# EAGLE schematic ARM Flight Controller (EAGLE 6.0)
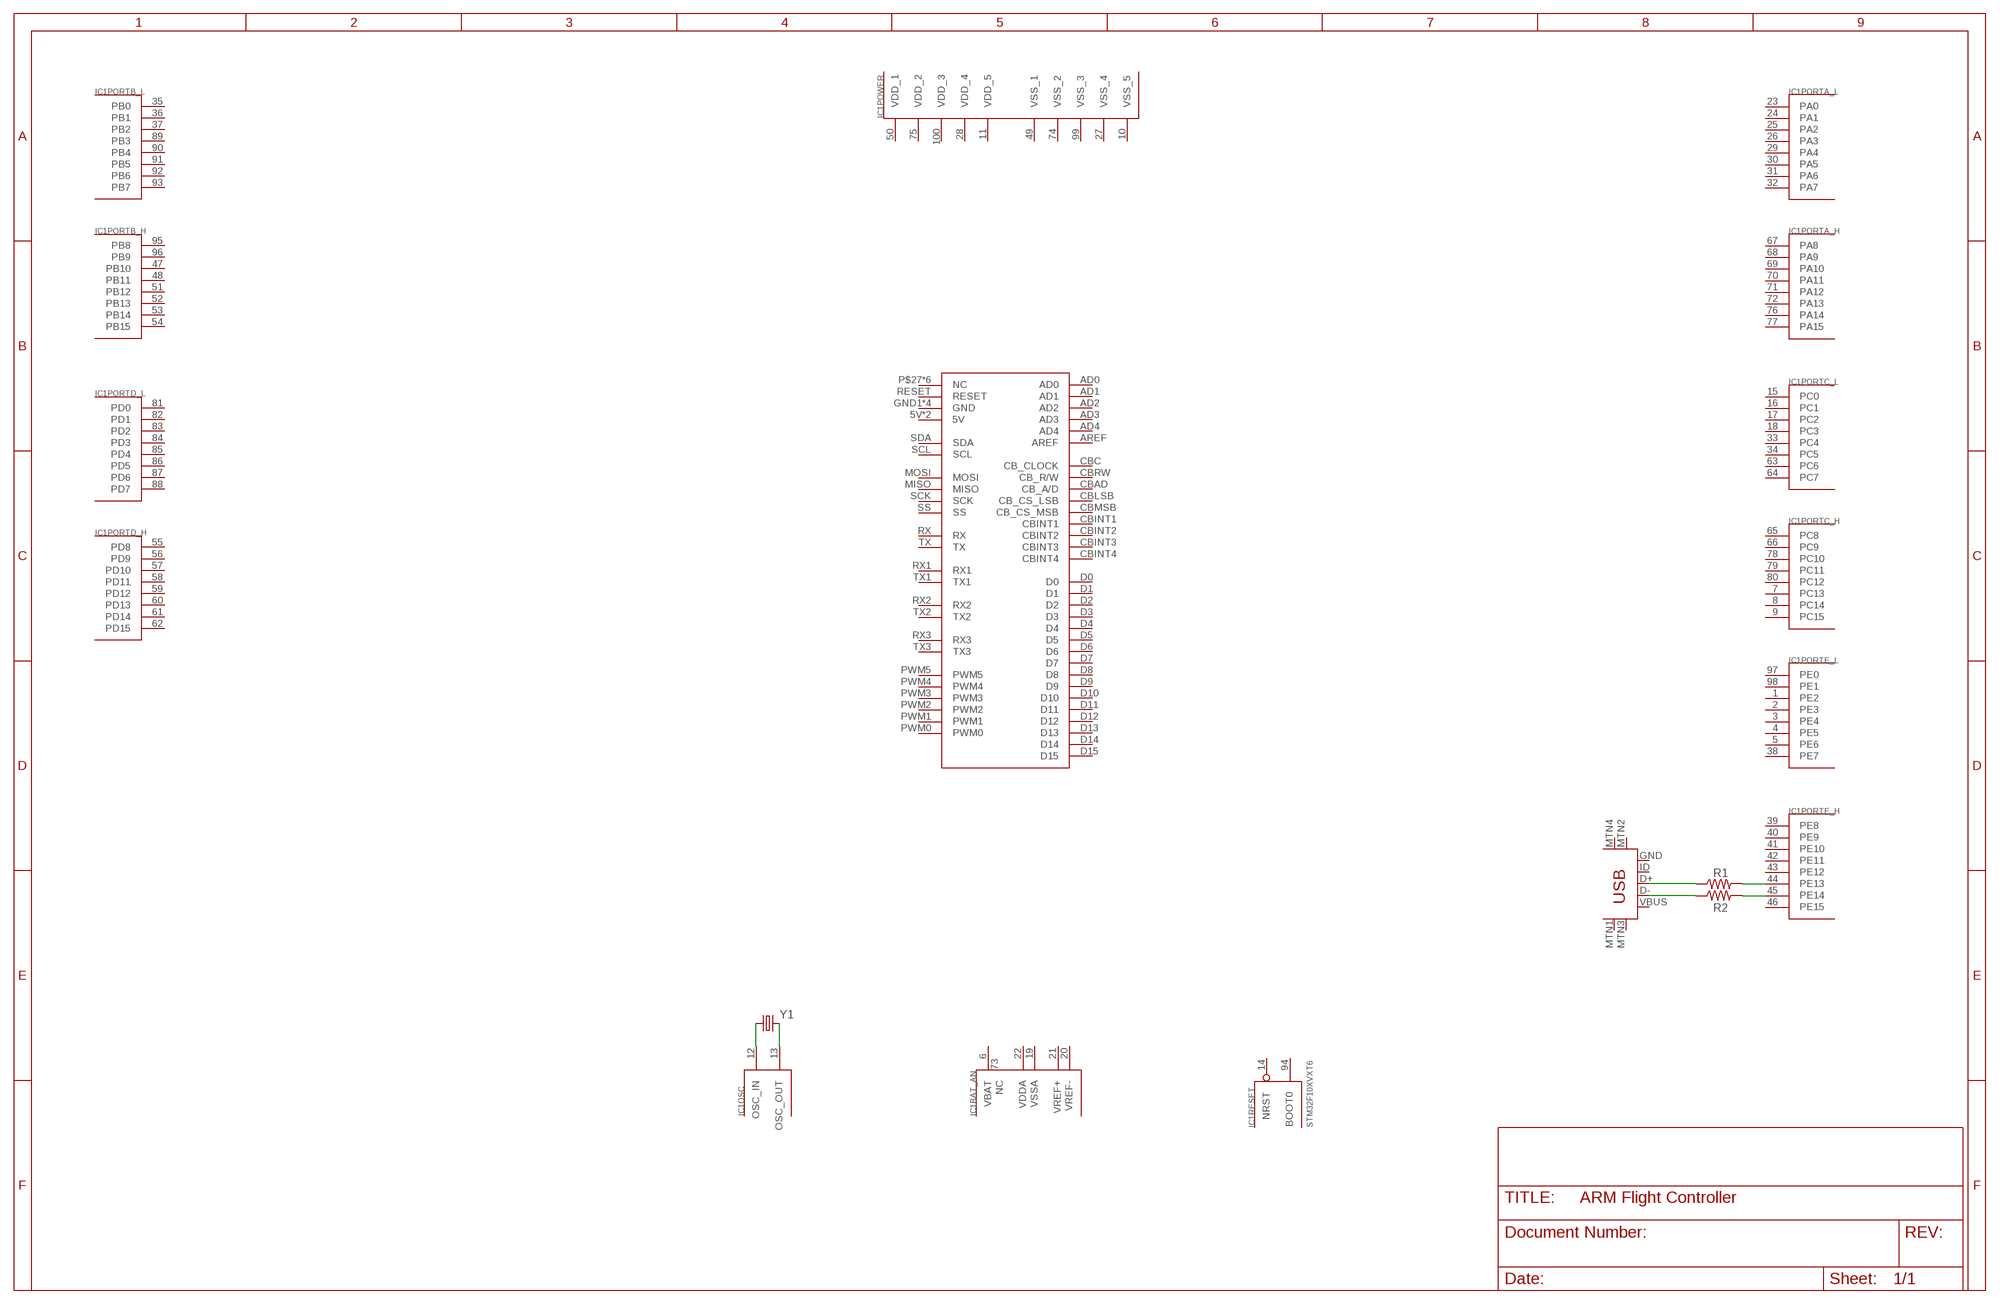
[diagram p0: schematic, sheet 1]

## Parts
IC1  STM32F10XVXT6  [TQFP100]
R1  RESISTOR0805-RES  [0805]
R2  RESISTOR0805-RES  [0805]
U$1  USB-MINIB-5PIN  [USB-MINIB]
U$2  MEGA_MININOSILK  [MEGAMINI_NOSILK]
Y1  CRYSTAL5X3  [CRYSTAL-SMD-5X3]

## Nets
N$1: R1.1 U$1.D+
N$2: R2.1 U$1.D-
N$3: IC1.44(PORTE_H:PE13) R1.2
N$4: IC1.45(PORTE_H:PE14) R2.2
N$5: IC1.13(OSC:OSC_OUT) Y1.3
N$6: IC1.12(OSC:OSC_IN) Y1.1
Unconnected: IC1.1(PORTE_L:PE2) IC1.2(PORTE_L:PE3) IC1.3(PORTE_L:PE4) IC1.4(PORTE_L:PE5) IC1.5(PORTE_L:PE6) IC1.7(PORTC_H:PC13) IC1.8(PORTC_H:PC14) IC1.9(PORTC_H:PC15) IC1.14(RESET:NRST) IC1.15(PORTC_L:PC0) IC1.16(PORTC_L:PC1) IC1.17(PORTC_L:PC2) IC1.18(PORTC_L:PC3) IC1.20(BAT_AN:VREF-) IC1.21(BAT_AN:VREF+) IC1.23(PORTA_L:PA0) IC1.24(PORTA_L:PA1) IC1.25(PORTA_L:PA2) IC1.26(PORTA_L:PA3) IC1.29(PORTA_L:PA4) IC1.30(PORTA_L:PA5) IC1.31(PORTA_L:PA6) IC1.32(PORTA_L:PA7) IC1.33(PORTC_L:PC4) IC1.34(PORTC_L:PC5) IC1.35(PORTB_L:PB0) IC1.36(PORTB_L:PB1) IC1.37(PORTB_L:PB2) IC1.38(PORTE_L:PE7) IC1.39(PORTE_H:PE8) IC1.40(PORTE_H:PE9) IC1.41(PORTE_H:PE10) IC1.42(PORTE_H:PE11) IC1.43(PORTE_H:PE12) IC1.46(PORTE_H:PE15) IC1.47(PORTB_H:PB10) IC1.48(PORTB_H:PB11) IC1.51(PORTB_H:PB12) IC1.52(PORTB_H:PB13) IC1.53(PORTB_H:PB14) IC1.54(PORTB_H:PB15) IC1.55(PORTD_H:PD8) IC1.56(PORTD_H:PD9) IC1.57(PORTD_H:PD10) IC1.58(PORTD_H:PD11) IC1.59(PORTD_H:PD12) IC1.60(PORTD_H:PD13) IC1.61(PORTD_H:PD14) IC1.62(PORTD_H:PD15) IC1.63(PORTC_L:PC6) IC1.64(PORTC_L:PC7) IC1.65(PORTC_H:PC8) IC1.66(PORTC_H:PC9) IC1.67(PORTA_H:PA8) IC1.68(PORTA_H:PA9) IC1.69(PORTA_H:PA10) IC1.70(PORTA_H:PA11) IC1.71(PORTA_H:PA12) IC1.72(PORTA_H:PA13) IC1.73(BAT_AN:NC) IC1.76(PORTA_H:PA14) IC1.77(PORTA_H:PA15) IC1.78(PORTC_H:PC10) IC1.79(PORTC_H:PC11) IC1.80(PORTC_H:PC12) IC1.81(PORTD_L:PD0) IC1.82(PORTD_L:PD1) IC1.83(PORTD_L:PD2) IC1.84(PORTD_L:PD3) IC1.85(PORTD_L:PD4) IC1.86(PORTD_L:PD5) IC1.87(PORTD_L:PD6) IC1.88(PORTD_L:PD7) IC1.89(PORTB_L:PB3) IC1.90(PORTB_L:PB4) IC1.91(PORTB_L:PB5) IC1.92(PORTB_L:PB6) IC1.93(PORTB_L:PB7) IC1.94(RESET:BOOT0) IC1.95(PORTB_H:PB8) IC1.96(PORTB_H:PB9) IC1.97(PORTE_L:PE0) IC1.98(PORTE_L:PE1) U$1.GND U$1.ID U$1.MTN1(MTN2) U$1.MTN2(MTN3) U$1.MTN3(MTN1) U$1.MTN4 U$1.VBUS U$2.5V U$2.5V2(5V) U$2.AD0 U$2.AD1 U$2.AD2 U$2.AD3 U$2.AD4 U$2.AREF U$2.CBAD(CB_A/D) U$2.CBC(CB_CLOCK) U$2.CBINT1 U$2.CBINT2 U$2.CBINT3 U$2.CBINT4 U$2.CBLSB(CB_CS_LSB) U$2.CBMSB(CB_CS_MSB) U$2.CBRW(CB_R/W) U$2.D0 U$2.D1 U$2.D2 U$2.D3 U$2.D4 U$2.D5 U$2.D6 U$2.D7 U$2.D8 U$2.D9 U$2.D10 U$2.D11 U$2.D12 U$2.D13 U$2.D14 U$2.D15 U$2.GND1(GND) U$2.GND2(GND) U$2.GND3(GND) U$2.GND4(GND) U$2.MISO U$2.MOSI U$2.P$27(NC) U$2.P$28(NC) U$2.P$29(NC) U$2.P$30(NC) U$2.P$38(NC) U$2.P$50(NC) U$2.PWM0 U$2.PWM1 U$2.PWM2 U$2.PWM3 U$2.PWM4 U$2.PWM5 U$2.RESET U$2.RX U$2.RX1 U$2.RX2 U$2.RX3 U$2.SCK U$2.SCL U$2.SDA U$2.SS U$2.TX U$2.TX1 U$2.TX2 U$2.TX3

## Power pins joined to a net without a drawn wire
VBAT: IC1.6(BAT_AN:VBAT)
VDD_1: IC1.50(POWER:VDD_1)
VDD_2: IC1.75(POWER:VDD_2)
VDD_3: IC1.100(POWER:VDD_3)
VDD_4: IC1.28(POWER:VDD_4)
VDD_5: IC1.11(POWER:VDD_5)
VDDA: IC1.22(BAT_AN:VDDA)
VSS_1: IC1.49(POWER:VSS_1)
VSS_2: IC1.74(POWER:VSS_2)
VSS_3: IC1.99(POWER:VSS_3)
VSS_4: IC1.27(POWER:VSS_4)
VSS_5: IC1.10(POWER:VSS_5)
VSSA: IC1.19(BAT_AN:VSSA)

## Library data of the parts
IC1 = stm32:STM32F10XVXT6: STM32F101/103 100 pin LQFP
R1 R2 = SparkFun:RESISTOR: Resistor Basic schematic elements and footprints for 0603, 1206, and PTH resistors.
U$1 = SparkFun:USB-MINIB: Mini-USB "B" connector with 5th pin broken out. Created new symbol breaking out 5th "ID" pin in mini/micro USB connector spec. See: http://en.wikipedia.org/wiki/Mini_usb#Cables. Uses same footprint as 4-pin symbol. Also added pins to connect to mounting / shield pads if required (probably not generally needed as signals aren't shielded once they leave the connector).
U$2 = terrys:MEGA_MINI
Y1 = SparkFun:CRYSTAL: Crystals Various standard crystals. Proven footprints. Spark Fun Electronics SKU : COM-00534